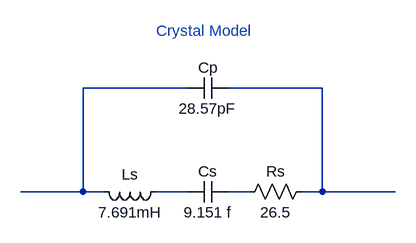
[diagram p0: schematic CrystalModel_EE412.asc]
CrystalModel_EE412.asc, the LTspice schematic file:
Version 4.1
SHEET 1 880 680
WIRE 160 -16 0 -16
WIRE 368 -16 224 -16
WIRE 0 144 0 -16
WIRE 0 144 -96 144
WIRE 32 144 0 144
WIRE 160 144 112 144
WIRE 256 144 224 144
WIRE 368 144 368 -16
WIRE 368 144 336 144
WIRE 480 144 368 144
SYMBOL ind 128 128 R90
WINDOW 0 5 56 VBottom 2
WINDOW 3 32 56 VTop 2
SYMATTR InstName Ls
SYMATTR Value 7.691mH
SYMBOL cap 224 128 R90
WINDOW 0 0 32 VBottom 2
WINDOW 3 32 32 VTop 2
SYMATTR InstName Cs
SYMATTR Value 9.151 f
SYMBOL res 352 128 R90
WINDOW 0 0 56 VBottom 2
WINDOW 3 32 56 VTop 2
SYMATTR InstName Rs
SYMATTR Value 26.5
SYMBOL cap 224 -32 R90
WINDOW 0 0 32 VBottom 2
WINDOW 3 32 32 VTop 2
SYMATTR InstName Cp
SYMATTR Value 28.57pF
TEXT 112 -104 Left 2 ;Crystal Model

The netlist it stands for:
* CrystalModel_EE412.asc
Ls N003 N001 7.691mH
Cs N004 N003 9.151 f
Rs N002 N004 26.5
Cp N002 N001 28.57pF
* Crystal Model
.backanno
.end